# EAGLE schematic Schematic (EAGLE 7.6.0)
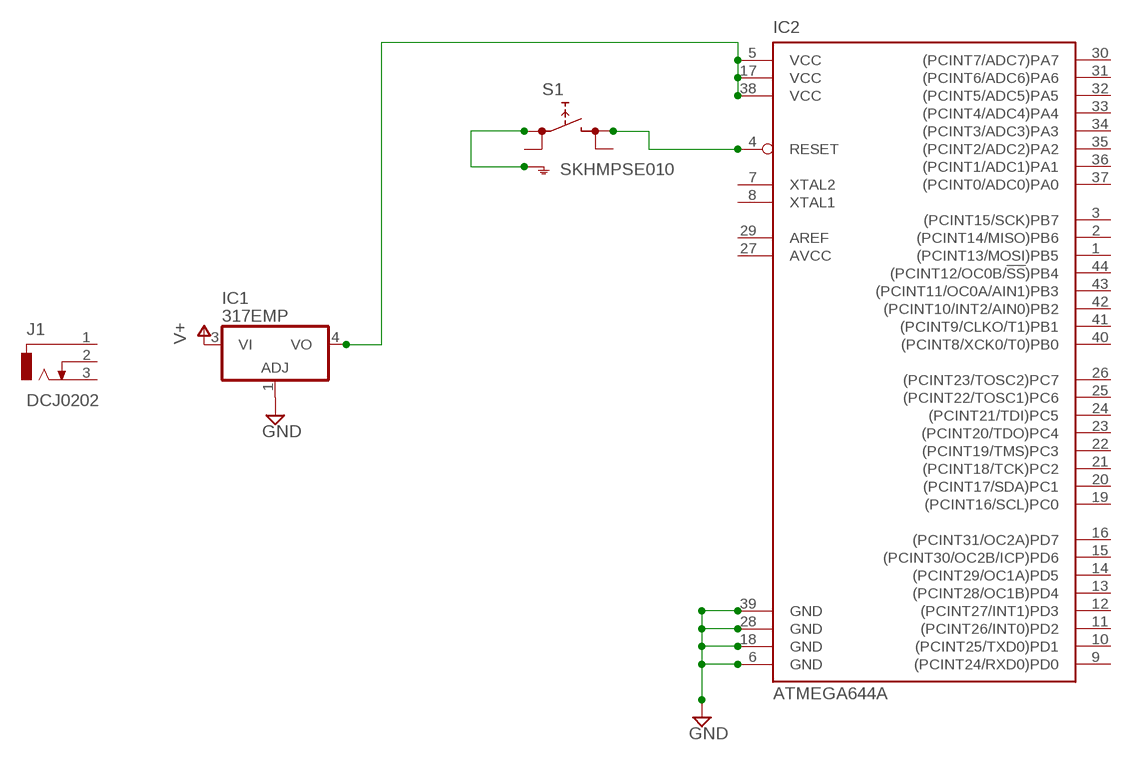
[diagram p0: schematic, sheet 1]

## Parts
IC1  317EMP  [SOT223]
IC2  ATMEGA644A  [TQFP44]
J1  DCJ0202  [DCJ0202]
S1  SKHMPSE010  [SKHMPXE010]

## Nets
GND: IC1.1(ADJ) IC2.6(GND) IC2.18(GND) IC2.28(GND) IC2.39(GND)
N$1: IC1.4(VO) IC2.5(VCC) IC2.17(VCC) IC2.38(VCC)
N$2: S1.1(1.1) S1.5(SH)
N$3: IC2.4(RESET) S1.3(2.1)
V+: IC1.3(VI)
Unconnected: IC2.1((PCINT13/MOSI)PB5) IC2.2((PCINT14/MISO)PB6) IC2.3((PCINT15/SCK)PB7) IC2.7(XTAL2) IC2.8(XTAL1) IC2.9((PCINT24/RXD0)PD0) IC2.10((PCINT25/TXD0)PD1) IC2.11((PCINT26/INT0)PD2) IC2.12((PCINT27/INT1)PD3) IC2.13((PCINT28/OC1B)PD4) IC2.14((PCINT29/OC1A)PD5) IC2.15((PCINT30/OC2B/ICP)PD6) IC2.16((PCINT31/OC2A)PD7) IC2.19((PCINT16/SCL)PC0) IC2.20((PCINT17/SDA)PC1) IC2.21((PCINT18/TCK)PC2) IC2.22((PCINT19/TMS)PC3) IC2.23((PCINT20/TDO)PC4) IC2.24((PCINT21/TDI)PC5) IC2.25((PCINT22/TOSC1)PC6) IC2.26((PCINT23/TOSC2)PC7) IC2.29(AREF) IC2.30((PCINT7/ADC7)PA7) IC2.31((PCINT6/ADC6)PA6) IC2.32((PCINT5/ADC5)PA5) IC2.33((PCINT4/ADC4)PA4) IC2.34((PCINT3/ADC3)PA3) IC2.35((PCINT2/ADC2)PA2) IC2.36((PCINT1/ADC1)PA1) IC2.37((PCINT0/ADC0)PA0) IC2.40((PCINT8/XCK0/T0)PB0) IC2.41((PCINT9/CLKO/T1)PB1) IC2.42((PCINT10/INT2/AIN0)PB2) IC2.43((PCINT11/OC0A/AIN1)PB3) IC2.44((PCINT12/OC0B/!SS!)PB4) J1.1 J1.2 J1.3 S1.2(1.2) S1.4(2.2)

## Power pins joined to a net without a drawn wire
AVCC: IC2.27(AVCC)

## Library data of the parts
IC1 = linear:*317: Positive VOLTAGE REGULATOR
IC2 = atmel:ATMEGA644: 8-bit Microcontroller with 64K Bytes In-System Programmable Flash Source: http://www.atmel.com/dyn/resources/prod_documents/doc2593.pdf; MPN: ATMEGA644PV-10AU; OC_FARNELL: 1455123; OC_NEWARK: 58M3748
J1 = con-jack:DCJ0202: DC POWER JACK Source: DCJ0202.pdf; OC_FARNELL: unknown; OC_NEWARK: unknown
S1 = switch:SKHMP*E010: 6.2 X 6.5mm TACT Switch (SMD) Source: http://www3.alps.co.jp/WebObjects/catalog.woa/PDF/E/Switch/Tact/SKHM/SKHM.PDF